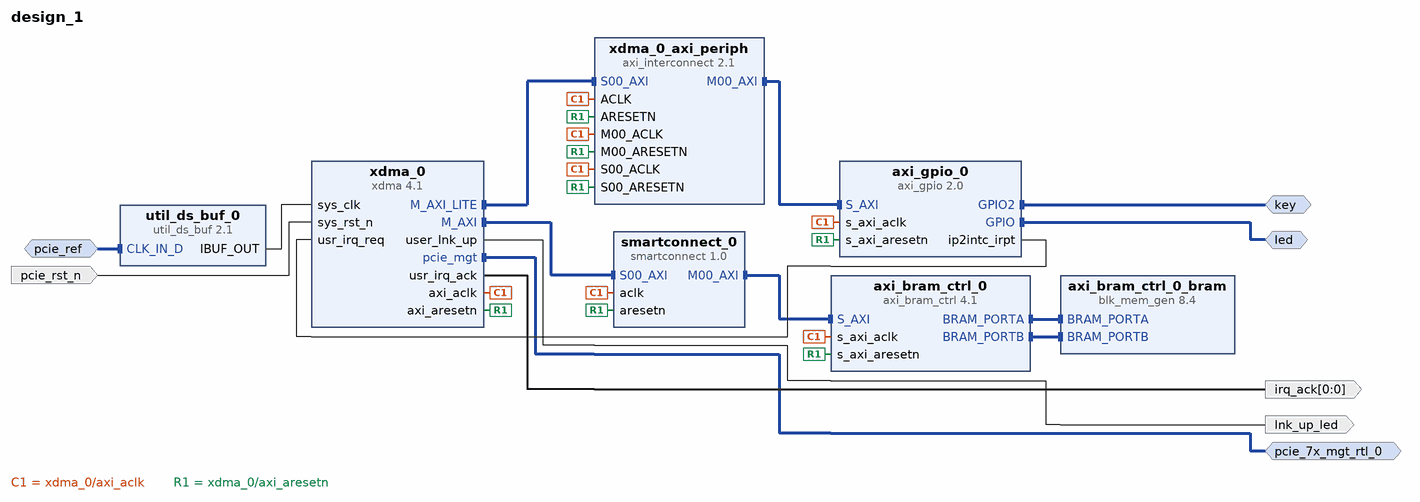
[diagram p0: block diagram of the top level]
# Vivado block design design_1, xc7a35tfgg484-2, Vivado 2019.2
create_bd_design design_1

create_bd_intf_port -mode Slave -vlnv xilinx.com:interface:diff_clock_rtl:1.0 pcie_ref
set_property -dict {CONFIG.FREQ_HZ 100000000} [get_bd_intf_ports pcie_ref]
create_bd_intf_port -mode Master -vlnv xilinx.com:interface:pcie_7x_mgt_rtl:1.0 pcie_7x_mgt_rtl_0
create_bd_intf_port -mode Master -vlnv xilinx.com:interface:gpio_rtl:1.0 led
create_bd_intf_port -mode Master -vlnv xilinx.com:interface:gpio_rtl:1.0 key
create_bd_port -dir I -type rst pcie_rst_n
set_property -dict {CONFIG.POLARITY ACTIVE_LOW} [get_bd_ports pcie_rst_n]
create_bd_port -dir O lnk_up_led
create_bd_port -dir O -from 0 -to 0 irq_ack

create_bd_cell -type ip -vlnv xilinx.com:ip:xdma:4.1 xdma_0
set_property -dict [list \
  CONFIG.PF0_DEVICE_ID_mqdma 9022 \
  CONFIG.PF2_DEVICE_ID_mqdma 9022 \
  CONFIG.PF3_DEVICE_ID_mqdma 9022 \
  CONFIG.axilite_master_en true \
  CONFIG.axisten_freq 125 \
  CONFIG.cfg_mgmt_if false \
  CONFIG.pciebar2axibar_axil_master 0x40000000 \
  CONFIG.pf0_device_id 7022 \
  CONFIG.pf0_interrupt_pin NONE \
  CONFIG.pf0_msi_enabled false \
  CONFIG.pf0_msix_cap_pba_bir BAR_3:2 \
  CONFIG.pf0_msix_cap_pba_offset 00008FE0 \
  CONFIG.pf0_msix_cap_table_bir BAR_3:2 \
  CONFIG.pf0_msix_cap_table_offset 00008000 \
  CONFIG.pf0_msix_cap_table_size 01F \
  CONFIG.pf0_msix_enabled true \
  CONFIG.pl_link_cap_max_link_speed 5.0_GT/s \
  CONFIG.pl_link_cap_max_link_width X2 \
  CONFIG.plltype QPLL1 \
  CONFIG.xdma_pcie_64bit_en true \
  CONFIG.xdma_rnum_chnl 2 \
  CONFIG.xdma_wnum_chnl 2 \
] [get_bd_cells xdma_0]
create_bd_cell -type ip -vlnv xilinx.com:ip:util_ds_buf:2.1 util_ds_buf_0
set_property -dict {CONFIG.C_BUF_TYPE IBUFDSGTE} [get_bd_cells util_ds_buf_0]
create_bd_cell -type ip -vlnv xilinx.com:ip:axi_bram_ctrl:4.1 axi_bram_ctrl_0
set_property -dict {CONFIG.DATA_WIDTH 64 CONFIG.SINGLE_PORT_BRAM 0} [get_bd_cells axi_bram_ctrl_0]
create_bd_cell -type ip -vlnv xilinx.com:ip:smartconnect:1.0 smartconnect_0
set_property -dict {CONFIG.NUM_SI 1} [get_bd_cells smartconnect_0]
create_bd_cell -type ip -vlnv xilinx.com:ip:blk_mem_gen:8.4 axi_bram_ctrl_0_bram
set_property -dict [list \
  CONFIG.EN_SAFETY_CKT false \
  CONFIG.Enable_B Use_ENB_Pin \
  CONFIG.Memory_Type True_Dual_Port_RAM \
  CONFIG.Port_B_Clock 100 \
  CONFIG.Port_B_Enable_Rate 100 \
  CONFIG.Port_B_Write_Rate 50 \
  CONFIG.Use_RSTB_Pin true \
] [get_bd_cells axi_bram_ctrl_0_bram]
create_bd_cell -type ip -vlnv xilinx.com:ip:axi_gpio:2.0 axi_gpio_0
set_property -dict [list \
  CONFIG.C_ALL_INPUTS_2 1 \
  CONFIG.C_ALL_OUTPUTS 1 \
  CONFIG.C_GPIO2_WIDTH 4 \
  CONFIG.C_GPIO_WIDTH 3 \
  CONFIG.C_INTERRUPT_PRESENT 1 \
  CONFIG.C_IS_DUAL 1 \
] [get_bd_cells axi_gpio_0]
create_bd_cell -type ip -vlnv xilinx.com:ip:axi_interconnect:2.1 xdma_0_axi_periph
set_property -dict {CONFIG.NUM_MI 1} [get_bd_cells xdma_0_axi_periph]

# ---- connections ----

connect_bd_intf_net [get_bd_intf_pins xdma_0_axi_periph/M00_AXI] [get_bd_intf_pins axi_gpio_0/S_AXI]
connect_bd_intf_net -intf_net diff_clock_rtl_0_1 [get_bd_intf_ports pcie_ref] [get_bd_intf_pins util_ds_buf_0/CLK_IN_D]
connect_bd_intf_net [get_bd_intf_pins axi_bram_ctrl_0_bram/BRAM_PORTA] [get_bd_intf_pins axi_bram_ctrl_0/BRAM_PORTA]
connect_bd_intf_net [get_bd_intf_pins smartconnect_0/M00_AXI] [get_bd_intf_pins axi_bram_ctrl_0/S_AXI]
connect_bd_intf_net [get_bd_intf_pins axi_bram_ctrl_0_bram/BRAM_PORTB] [get_bd_intf_pins axi_bram_ctrl_0/BRAM_PORTB]
connect_bd_intf_net [get_bd_intf_pins xdma_0/M_AXI_LITE] [get_bd_intf_pins xdma_0_axi_periph/S00_AXI]
connect_bd_intf_net [get_bd_intf_ports led] [get_bd_intf_pins axi_gpio_0/GPIO]
connect_bd_intf_net [get_bd_intf_pins xdma_0/M_AXI] [get_bd_intf_pins smartconnect_0/S00_AXI]
connect_bd_intf_net [get_bd_intf_ports key] [get_bd_intf_pins axi_gpio_0/GPIO2]
connect_bd_intf_net [get_bd_intf_ports pcie_7x_mgt_rtl_0] [get_bd_intf_pins xdma_0/pcie_mgt]
connect_bd_net [get_bd_pins xdma_0/axi_aclk] \
  [get_bd_pins smartconnect_0/aclk] [get_bd_pins axi_bram_ctrl_0/s_axi_aclk] [get_bd_pins xdma_0_axi_periph/S00_ACLK] \
  [get_bd_pins axi_gpio_0/s_axi_aclk] [get_bd_pins xdma_0_axi_periph/M00_ACLK] [get_bd_pins xdma_0_axi_periph/ACLK]
connect_bd_net [get_bd_pins xdma_0/axi_aresetn] \
  [get_bd_pins axi_bram_ctrl_0/s_axi_aresetn] [get_bd_pins smartconnect_0/aresetn] \
  [get_bd_pins xdma_0_axi_periph/S00_ARESETN] [get_bd_pins axi_gpio_0/s_axi_aresetn] \
  [get_bd_pins xdma_0_axi_periph/M00_ARESETN] [get_bd_pins xdma_0_axi_periph/ARESETN]
connect_bd_net -net reset_rtl_0_1 [get_bd_ports pcie_rst_n] [get_bd_pins xdma_0/sys_rst_n]
connect_bd_net [get_bd_pins util_ds_buf_0/IBUF_OUT] [get_bd_pins xdma_0/sys_clk]
connect_bd_net [get_bd_pins xdma_0/user_lnk_up] [get_bd_ports lnk_up_led]
connect_bd_net [get_bd_pins axi_gpio_0/ip2intc_irpt] [get_bd_pins xdma_0/usr_irq_req]
connect_bd_net [get_bd_pins xdma_0/usr_irq_ack] [get_bd_ports irq_ack]

# ---- address map ----
assign_bd_address -offset 0x0000000000000000 -range 8K -target_address_space [get_bd_addr_spaces xdma_0/M_AXI] [get_bd_addr_segs axi_bram_ctrl_0/S_AXI/Mem0]
assign_bd_address -offset 0x40000000 -range 64K -target_address_space [get_bd_addr_spaces xdma_0/M_AXI_LITE] [get_bd_addr_segs axi_gpio_0/S_AXI/Reg]

validate_bd_design
save_bd_design
